# EAGLE design RJ45Split (EAGLE 6.6.0)
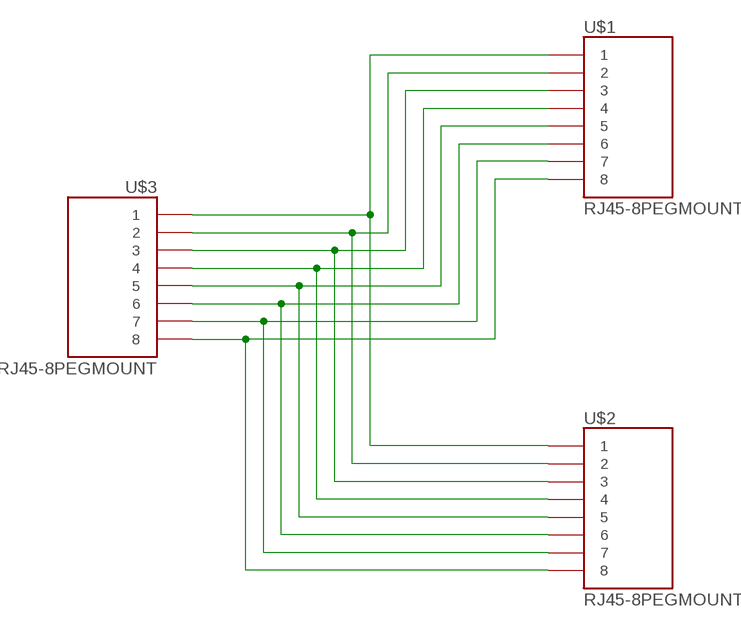
[diagram p0: schematic, sheet 1]

## Parts
U$1  RJ45-8PEGMOUNT  [MOLEX-0955016889]
U$2  RJ45-8PEGMOUNT  [MOLEX-0955016889]
U$3  RJ45-8PEGMOUNT  [MOLEX-0955016889]

## Nets
N$1: U$1.P$1 U$2.P$1 U$3.P$1
N$2: U$1.P$2 U$2.P$2 U$3.P$2
N$3: U$1.P$3 U$2.P$3 U$3.P$3
N$4: U$1.P$4 U$2.P$4 U$3.P$4
N$5: U$1.P$5 U$2.P$5 U$3.P$5
N$6: U$1.P$6 U$2.P$6 U$3.P$6
N$7: U$1.P$7 U$2.P$7 U$3.P$7
N$8: U$1.P$8 U$2.P$8 U$3.P$8

## Library data of the parts
U$1-U$3 = GW-devices:RJ45-8: RJ45 Jack MFG part number 54602-908lf

## Board
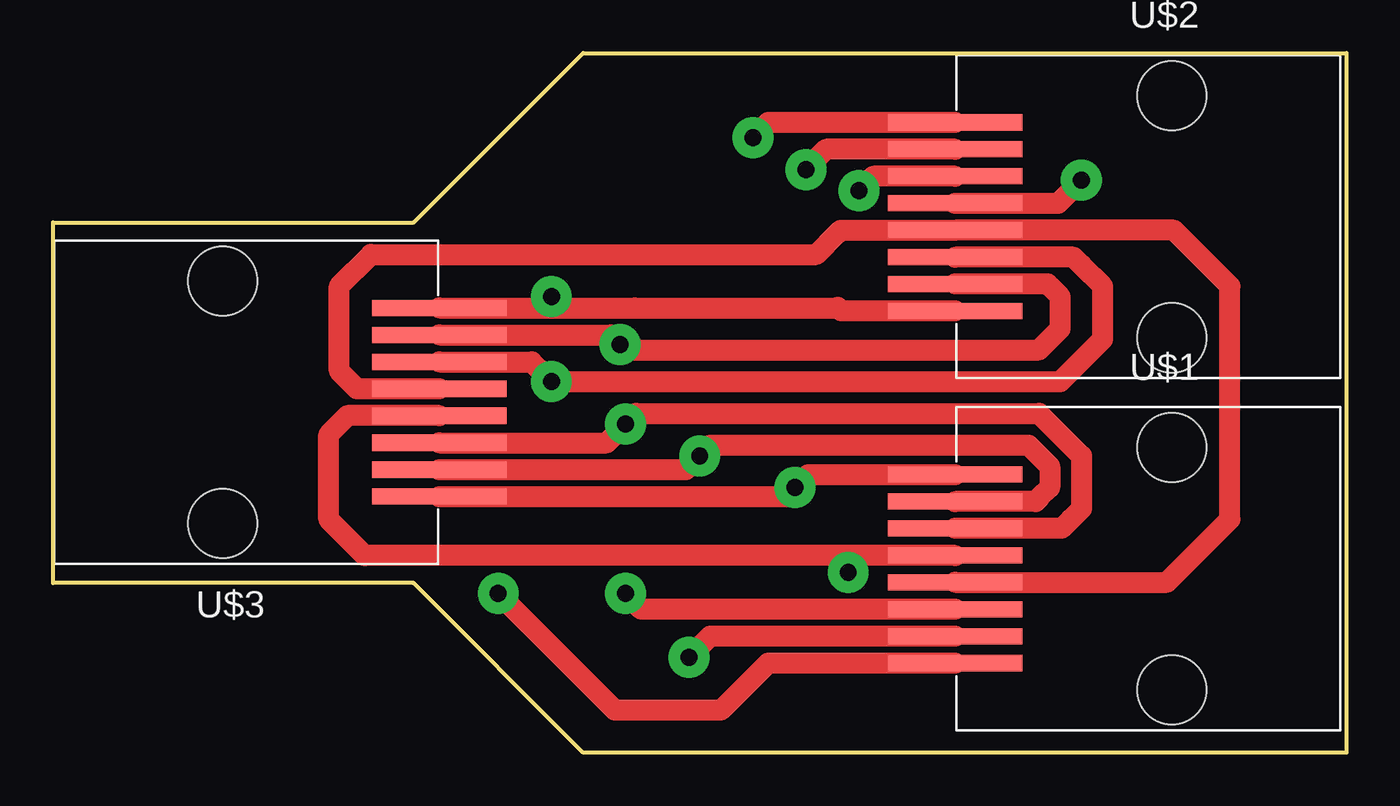
[diagram p1: board, top side]
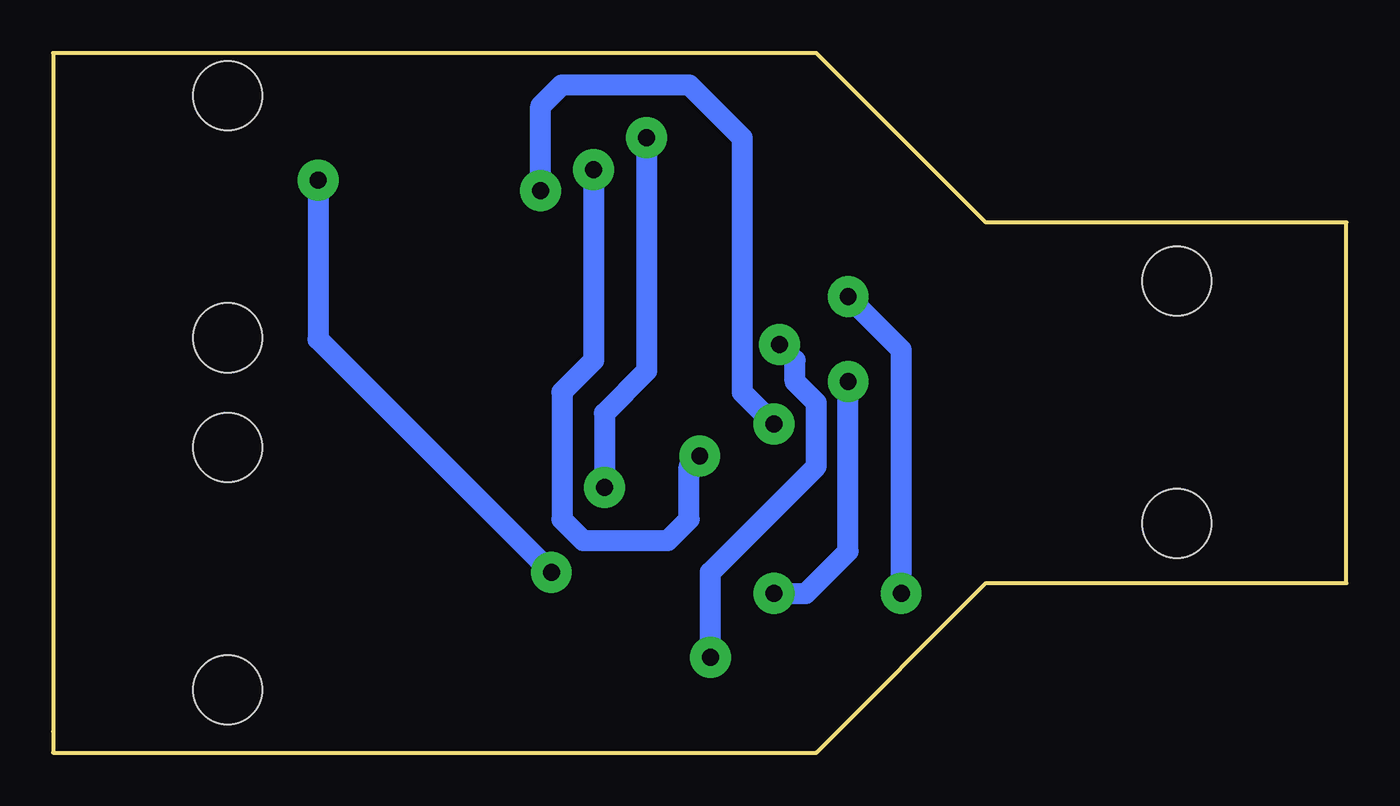
[diagram p2: board, bottom side, seen from below]

Size 61 x 33 mm. Coordinates in mm from the lower left corner, seen from the top.
Outline: 0,8 0,25 17,25 25,33 61,33 61,1 61,0 25,0 17,8 0,8
Copper layers (1*16): Top 0.035mm / dielectric 1.5mm / Bottom 0.035mm
Design rules "default *": minimum track width 10mil, minimum drill 24mil, track to track 0.25mm, track to pad 0.25mm, pad to pad 0.25mm, via to via 0.25mm, smd to smd 0.25mm, copper to edge 0.25mm, drill to drill 0.25mm, minimum pad ring 10mil, minimum via ring 8mil, stop-mask expansion 4mil, vias tented up to drill 0mil, thermal gap 10mil

### Footprints (pad centres in the part's own frame; a part is rotated, then mirrored left to right if it is on the bottom)
MOLEX-0955016889 = smd 0.76 x 6.35: P$1 -4.45,10.225; P$2 -3.18,10.225; P$3 -1.91,10.225; P$4 -0.64,10.225; P$5 0.63,10.225; P$6 1.905,10.225; P$7 3.175,10.225; P$8 4.445,10.225 | hole 3.25: -5.715,0; 5.715,0

### Placement (x,y rotation side)
U$1  52.77,8.67 90 top
U$2  52.77,25.28 90 top
U$3  8,16.52 270 top

### Tracks (layer width: path | path; a pad name or v marks a point on that pad's centre or on a via)
N$1  (via drill 0.8 pad 1.93)
  Top 1: U$3.P$1 24,20.97 | 24,20.97 27.45,20.97 36.97,20.97 37,21 37.17,20.83 U$2.P$1 | U$1.P$1 33.72,4.22 31.5,2 26.5,2 v21,7.5 | v23.5,21.5 23.5,21.47 24,20.97
  Bottom 1: v21,7.5 21,19 v23.5,21.5
N$2  (via drill 0.8 pad 1.93)
  Top 1: U$3.P$2 26.3,19.7 v26.75,19.25 | v26.75,19.25 27,19 27.5,19 | 27.5,19 46.5,19 47.5,20 47.5,21.5 47,22 46.9,22.1 U$2.P$2 | U$1.P$2 30.99,5.49 v30,4.5 | v26.75,19.25 27.25,19.25 27.5,19
  Bottom 1: v30,4.5 30,8.5 25,13.5 25,16.5 26,17.5 26,18.5 v26.75,19.25
N$3  (via drill 0.8 pad 1.93)
  Top 1: U$3.P$3 22.57,18.43 v23.5,17.5 47.5,17.5 49.5,19.5 49.5,22 48.5,23 48.13,23.37 U$2.P$3 | U$1.P$3 27.74,6.76 v27,7.5
  Bottom 1: v27,7.5 25.5,7.5 23.5,9.5 v23.5,17.5
N$4
  Top 1: U$3.P$4 14.34,17.16 13.5,18 13.5,22 15,23.5 36,23.5 37,24.5 37.14,24.64 U$2.P$4 52.86,24.64 53,24.5 55.5,22 55.5,11 52.53,8.03 U$1.P$4
N$5  (via drill 0.8 pad 1.93)
  Top 1: U$3.P$5 13.89,15.89 13,15 13,11 14.7,9.3 37.5,9.3 | U$1.P$5 37.5,9.3 | U$2.P$5 47.41,25.91 v48.5,27 | v37.5,8.5 37.5,9.3
  Bottom 1: v48.5,27 48.5,19.5 v37.5,8.5
N$6  (via drill 0.8 pad 1.93)
  Top 1: U$3.P$6 26.12,14.61 v27,15.5 27.5,16 46.5,16 48.5,14 48.5,11.5 48,11 47.58,10.58 U$1.P$6 | U$2.P$6 38.69,27.19 v38,26.5
  Bottom 1: v38,26.5 38,30.5 37,31.5 31,31.5 28.5,29 28.5,17 v27,15.5
N$7  (via drill 0.8 pad 1.93)
  Top 1: U$3.P$7 29.84,13.34 v30.5,14 31,14.5 46,14.5 47,13.5 47,12.5 46.5,12 46.34,11.84 U$1.P$7 | U$2.P$7 36.45,28.45 v35.5,27.5
  Bottom 1: v35.5,27.5 35.5,18.5 37,17 37,11 36,10 32,10 31,11 31,13.5 v30.5,14
N$8  (via drill 0.8 pad 1.93)
  Top 1: U$3.P$8 30.57,12.08 34.58,12.08 v35,12.5 35.62,13.11 U$1.P$8 | U$2.P$8 33.73,29.72 v33,29
  Bottom 1: v33,29 33,18 35,16 v35,12.5